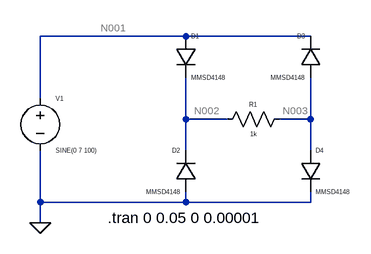
[diagram p0: schematic Problem01.asc]
Problem01.asc, the LTspice schematic file:
Version 4
SHEET 1 880 680
WIRE 256 -112 32 -112
WIRE 448 -112 256 -112
WIRE 32 -16 32 -112
WIRE 256 16 256 -48
WIRE 320 16 256 16
WIRE 448 16 448 -48
WIRE 448 16 400 16
WIRE 256 64 256 16
WIRE 448 64 448 16
WIRE 32 144 32 64
WIRE 256 144 256 128
WIRE 256 144 32 144
WIRE 448 144 448 128
WIRE 448 144 256 144
WIRE 32 176 32 144
FLAG 32 176 0
SYMBOL voltage 32 -32 R0
WINDOW 0 24 16 Left 0
WINDOW 3 24 96 Left 0
WINDOW 123 0 0 Left 0
WINDOW 39 0 0 Left 0
SYMATTR InstName V1
SYMATTR Value SINE(0 7 100)
SYMBOL diode 240 -112 R0
WINDOW 0 24 0 Left 0
WINDOW 3 24 64 Left 0
SYMATTR InstName D1
SYMATTR Value MMSD4148
SYMBOL diode 272 128 R180
WINDOW 0 24 64 Left 0
WINDOW 3 24 0 Left 0
SYMATTR InstName D2
SYMATTR Value MMSD4148
SYMBOL res 416 0 R90
WINDOW 0 0 56 VBottom 0
WINDOW 3 32 56 VTop 0
SYMATTR InstName R1
SYMATTR Value 1k
SYMBOL diode 464 -48 R180
WINDOW 0 24 64 Left 0
WINDOW 3 24 0 Left 0
SYMATTR InstName D3
SYMATTR Value MMSD4148
SYMBOL diode 432 64 R0
WINDOW 0 24 0 Left 0
WINDOW 3 24 64 Left 0
SYMATTR InstName D4
SYMATTR Value MMSD4148
TEXT 136 168 Left 2 !.tran 0 0.05 0 0.00001

The netlist it stands for:
* Problem01.asc
V1 N001 0 SINE(0 7 100)
D1 N001 N002 MMSD4148
D2 0 N002 MMSD4148
R1 N003 N002 1k
D3 N003 N001 MMSD4148
D4 N003 0 MMSD4148
.model D D
.lib standard.dio
.tran 0 0.05 0 0.00001
.backanno
.end

* Results of the author's LTspice run, read from the files saved beside the schematic
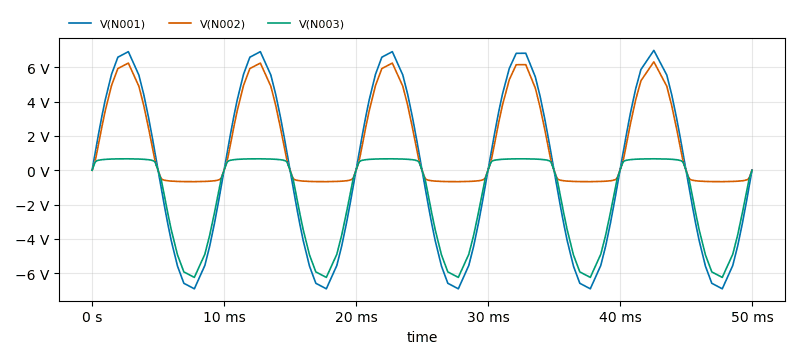
[diagram p1: Transient Analysis of Problem01.asc, plotted from the saved traces]
* Transient Analysis, 1 run:
*   V(N001): min -6.913 V, max 6.989 V, average -2.568 mV, rms 4.892 V, last 0 V
*   V(N002): min -665.4 mV, max 6.322 V, average 1.601 V, rms 3.081 V, last 0 V
*   V(N003): min -6.247 V, max 666.1 mV, average -1.603 V, rms 3.085 V, last 0 V